# Altium schematic sheet booz_power_board.SchDoc
size A
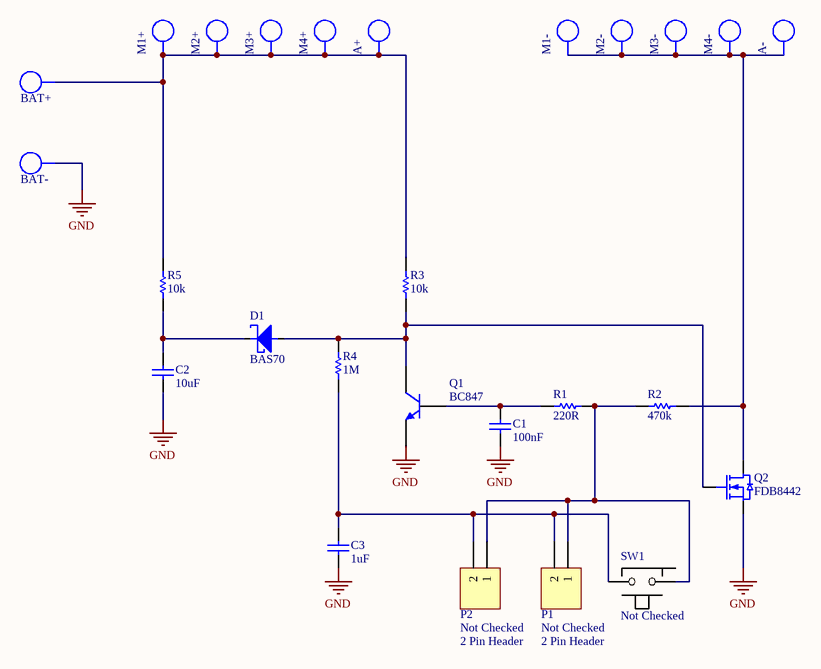
[diagram p0: booz_power_board.SchDoc]

## Parts
A+  (no value)  [BOOZ_MOTOR]
A-  (no value)  [BOOZ_MOTOR]
BAT+  (no value)  [BOOZ_POWER]
BAT-  (no value)  [BOOZ_POWER]
C1  100nF  [0603]
C2  value 10uF  [1206]  (hidden comment: CP_10uF_25V_1206)
C3  1uF  [0603]
D1  BAS70  [SOT23]
M1+  (no value)  [BOOZ_MOTOR]
M1-  (no value)  [BOOZ_MOTOR]
M2+  (no value)  [BOOZ_MOTOR]
M2-  (no value)  [BOOZ_MOTOR]
M3+  (no value)  [BOOZ_MOTOR]
M3-  (no value)  [BOOZ_MOTOR]
M4+  (no value)  [BOOZ_MOTOR]
M4-  (no value)  [BOOZ_MOTOR]
P1  Verify: Not Checked  [CONN_2X1_SMT_RA_1.25MM]  (hidden comment: 2 Pin Header)
P2  Verify: Not Checked  [CONN_2X1_SMT_RA_1.25MM]  (hidden comment: 2 Pin Header)
Q1  BC847  [SOT23]
Q2  FDB8442  [TO-263AB]
R1  220R  [1206]
R2  470k  [0603]
R3  10k  [1206]
R4  1M  [0603]
R5  10k  [0603]
SW1  Verify: Not Checked  [PUSHBUTTON_B3U]  (hidden comment: Push Button Switch)

## Nets
GND: BAT-.1 C1.1 C2.1 C3.1 Q1.2(E) Q2.3(S)
NetA+_1: A+.1 BAT+.1 M1+.1 M2+.1 M3+.1 M4+.1 R3.2 R5.2
NetA-_1: A-.1 M1-.1 M2-.1 M3-.1 M4-.1 Q2.4(D) R2.2
NetC1_2: C1.2 Q1.1(B) R1.1
NetC2_2: C2.2 D1.3(K) R5.1
NetC3_2: C3.2 P1.2 P2.2 R4.1 SW1.2
NetD1_1: D1.1(A) Q1.3(C) Q2.1(G) R3.1 R4.2
NetP1_1: P1.1 P2.1 R1.2 R2.1 SW1.1

Not connected (* = marked no-connect by the designer): SW1 3(GND)

## Library data of the parts
A+ A- BAT+ BAT- M1+ M1- M2+ M2- M3+ M3- M4+ M4- = JP_BOOZ_PAD: Pad for booz power board; LatestRevisionDate: 24 Jun 09
C1 = CP_100nF 0603: CAP CER .10UF 50V X5R 0603; Manufacturer: Taiyo Yuden; Manufacturer PN: UMK107B7104KA-T; Prototype: Digikey 587-1243-1-ND; LatestRevisionDate: 29 May 08; Value: 100nF
C2 = CP_10uF_25V_1206: CAP CER 10uF 25V X5R 1206; Manufacturer: Panasonic; Manufacturer PN: ECJ-3YB1E106; Prototype: Digikey PCC2414CT-ND; LatestRevisionDate: 25 June 09
C3 = CP_1uF 0603: CAP CER 1.0UF 50V X5S 0603; Manufacturer: Taiyo Yuden; Manufacturer PN: UMK107C5105KA-T; Prototype: Digikey 587-1257-1-ND; Value: 1uF
D1 = DS_BAS70: DIODE SCHOTTKY 70V 200MA SOT23; Manufacturer: ST Micro; Manufacturer PN: BAS70-TP; Prototype: Digikey BAS70TPMSCT-ND; Value: BAS70
P1 P2 = JP_2PIN HDR_SMT_RA_MOLEX: CONN HDR VERT 2POS .100" SNGL; Manufacturer: Molex; Manufacturer PN: 53261-0271; Prototype: Digikey WM7620CT-ND; LatestRevisionDate: 24 Jun 08; Value: 2 Pin Header
Q1 = TN_BC847: TRANS NPN GP 100MA 45V SOT23; Manufacturer: NXP Semiconductors; Manufacturer PN: BC847C T/R; Prototype: Digikey 568-1636-2-ND; LatestRevisionDate: 2  Jun 08; Value: BC847
Q2 = TF_FDB8442: MOSFET N-CH 40V 80A D2PAK; Manufacturer: Fairchild; Prototype: Digikey  FDB8442CT-ND; Verify: Not Checked; LatestRevisionDate: 25 June 09; Manufacturer PN: FDB8442; Value: FDB8442
R1 = RS_220R 1206: RES 220 OHM 1/4W 1% 1206 SMD; Manufacturer: Vishay/Dale; Manufacturer PN: CRCW1206220RFKEA; Prototype: DigiKey 541-220FCT-ND; LatestRevisionDate: 25 June 2009; Value: 220R
R2 = RS_470k 0603: RES 470K OHM 1/10W 5% 0603 SMD; Manufacturer: Yagep; Manufacturer PN: RC0603JR-07470KL; Prototype: Digikey 311-470KGRCT-ND; LatestRevisionDate: 25 June 2009; Value: 470k
R3 = RS_10k 1206: RES 10.0K OHM 1/4W 1% 1206 SMD; Manufacturer: Vishay/Dale; Manufacturer PN: CRCW120610K0FKEA; Prototype: DigiKey 541-10.0KFCT-ND; LatestRevisionDate: 25 June 2009; Value: 10k
R4 = RS_1M 0603: RES 1.00M OHM 1/10W 1% 0603 SMD; Manufacturer: Yageo; Manufacturer PN: RC0603FR-071ML; Prototype: DigiKey 311-1.00MHRCT-ND; LatestRevisionDate: 1 Jun 08; Value: 1M
R5 = RS_10k 0603: RES 10.0K OHM 1/10W 1% 0603 SMD; Manufacturer: Yageo; Manufacturer PN: RC0603FR-0710KL; Prototype: DigiKey 311-10.0KHRCT-ND; LatestRevisionDate: 29 May 08; Value: 10k
SW1 = SW_TACT 3MM RT: SWITCH TACT RT ANG SPST SMD; Manufacturer: Omron; Manufacturer PN: B3U-3100P; Prototype: SW1023CT-ND; LatestRevisionDate: 22 Jun 08; Value: Push Button Switch